# Altium schematic sheet ESP32.SchDoc
size A; SheetNumber: 2; SheetTotal: 6
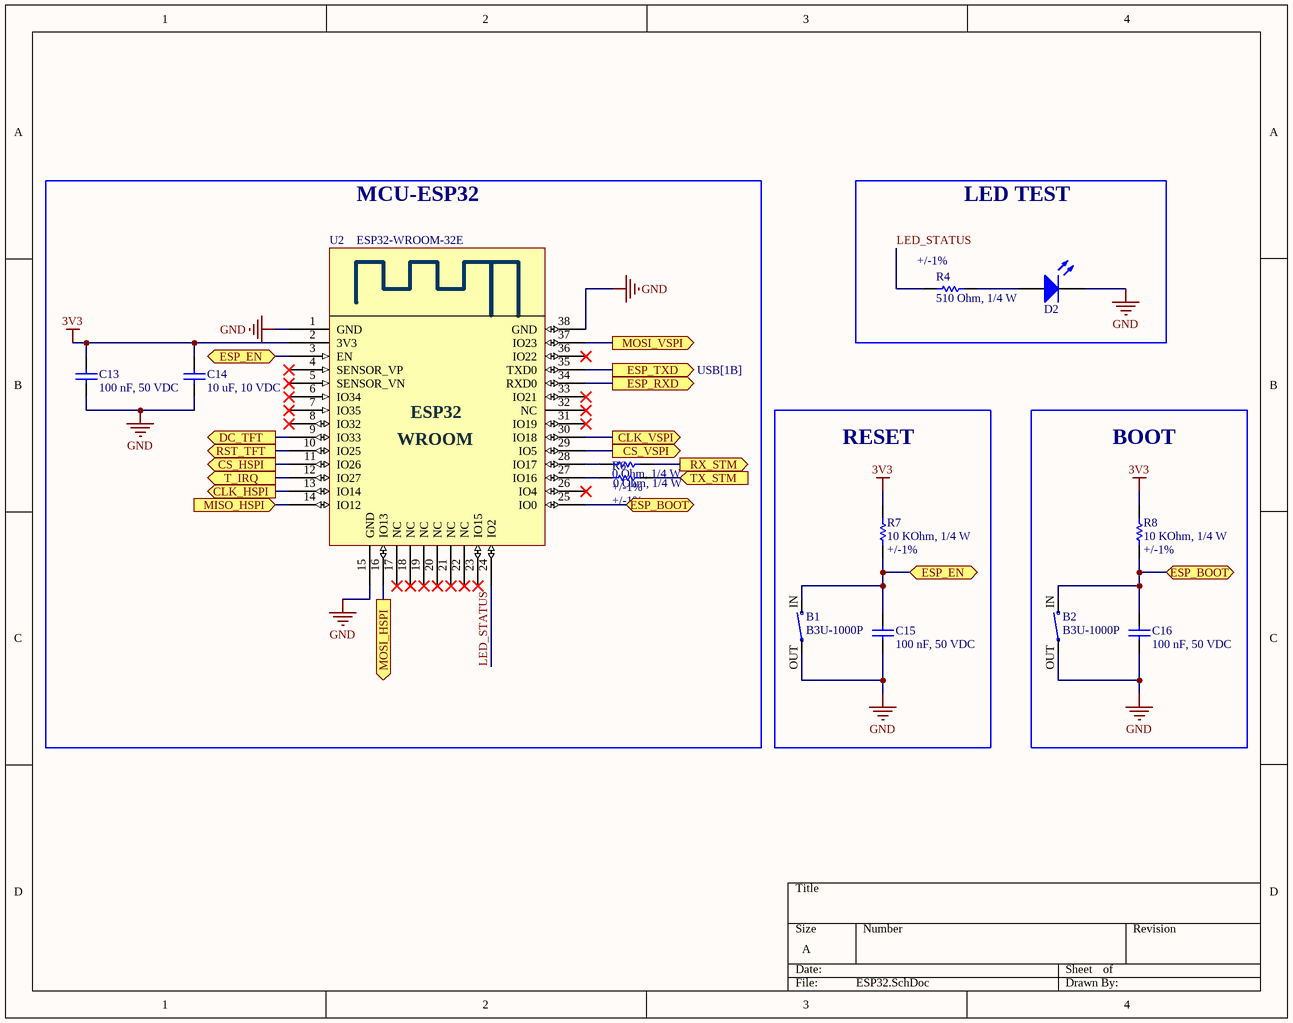
[diagram p0: ESP32.SchDoc]

## Parts
B1  B3U-1000P  [SODFL4025X160N]
B2  B3U-1000P  [SODFL4025X160N]
C13  100 nF, 50 VDC  [CAP_0603]
C14  10 uF, 10 VDC  [CAP_0603]
C15  100 nF, 50 VDC  [CAP_0603]
C16  100 nF, 50 VDC  [CAP_0603]
D2  LED SMD  [LED_0805_Blue]  (value not drawn)
R4  510 Ohm, 1/4 W  Resistance Tolerance: +/-1%  [resistor_0603]
R5  0 Ohm, 1/4 W  Resistance Tolerance: +/-1%  [resistor_0603]
R6  0 Ohm, 1/4 W  Resistance Tolerance: +/-1%  [resistor_0603]
R7  10 KOhm, 1/4 W  Resistance Tolerance: +/-1%  [resistor_0603]
R8  10 KOhm, 1/4 W  Resistance Tolerance: +/-1%  [resistor_0603]
U2  ESP32-WROOM-32E  [ESP32-WROOM]

## Blocks framed on the sheet
MCU-ESP32: C13 C14 R5 R6 U2
LED TEST: D2 R4
RESET: B1 C15 R7
BOOT: B2 C16 R8

## Ports
CLK_HSPI (out, see Input[4B]), CLK_VSPI (out, see Output[4A]), CS_HSPI (out, see Input[4B]), CS_VSPI (out, see Output[4A]), DC_TFT (out, see Output[4A]), ESP_BOOT (bidir, see ESP32[2B], USB[2D]), ESP_BOOT (bidir, see ESP32[4C], USB[2D]), ESP_EN (bidir, see ESP32[1B], USB[2C]), ESP_EN (bidir, see ESP32[3C], USB[2C]), ESP_RXD (out, see USB[1B]), ESP_TXD (out, see USB[1B]), MISO_HSPI (in, see Input[4B]), MOSI_HSPI (out, see Input[4B]), MOSI_VSPI (out, see Output[4A]), RST_TFT (out, see Output[4A]), RX_STM (out, see MCU[1A]), T_IRQ (out, see Input[4B]), TX_STM (in, see MCU[1A])

## Nets
3V3: C13.2 C14.2 R7.2 R8.2 U2.2(3V3)
GND: B1.OUT B2.OUT C13.1 C14.1 C15.1 C16.1 D2.2(K) U2.1(GND) U2.15(GND) U2.38(GND)
CLK_HSPI: U2.13(IO14) ; port CLK_HSPI
CLK_VSPI: U2.30(IO18) ; port CLK_VSPI
CS_HSPI: U2.11(IO26) ; port CS_HSPI
CS_VSPI: U2.29(IO5) ; port CS_VSPI
DC_TFT: U2.9(IO33) ; port DC_TFT
ESP_BOOT: B2.IN C16.2 R8.1 U2.25(IO0) ; port ESP_BOOT
ESP_EN: B1.IN C15.2 R7.1 U2.3(EN) ; port ESP_EN
ESP_RXD: U2.34(RXD0) ; port ESP_RXD
ESP_TXD: U2.35(TXD0) ; port ESP_TXD
LED_STATUS: R4.1 U2.24(IO2)
MISO_HSPI: U2.14(IO12) ; port MISO_HSPI
MOSI_HSPI: U2.16(IO13) ; port MOSI_HSPI
MOSI_VSPI: U2.37(IO23) ; port MOSI_VSPI
RST_TFT: U2.10(IO25) ; port RST_TFT
RX_STM: R5.1 ; port RX_STM
T_IRQ: U2.12(IO27) ; port T_IRQ
TX_STM: R6.1 ; port TX_STM
NetD2_1: D2.1(A) R4.2
NetR5_2: R5.2 U2.28(IO17)
NetR6_2: R6.2 U2.27(IO16)

Not connected (* = marked no-connect by the designer): U2 4(SENSOR_VP)* 5(SENSOR_VN)* 6(IO34)* 7(IO35)* 8(IO32)* 17(NC)* 18(NC)* 19(NC)* 20(NC)* 21(NC)* 22(NC)* 23(IO15)* 26(IO4)* 31(IO19)* 32(NC)* 33(IO21)* 36(IO22)*

## Notes on the sheet
- (in symbol ESP32-WROOM) WROOM

## Library data of the parts
B1 B2 = B3U-1000P: Switch Tactile N.O. SPST Round Button Gull Wing 0.05A 12VDC 1.5N SMD T/R; MF: Omron; MP: B3U1000P; SnapEDA_Link: https://www.snapeda.com/parts/B3U1000P/Omron/view-part/?ref=snap; Package: None; Value: *; Check_prices: https://www.snapeda.com/parts/B3U1000P/Omron/view-part/?ref=eda
C13 C15 C16 = 0106031041050: CAP, size 0603, 100 nF, 50 VDC; Manufacture Name: TDK; Manufacture SN: CGA3E3X8R1H104K080AE; Capacitance: 100 nF; Tolerance: +/-10%; Voltage Rating DC: 50 VDC; ComponentLink2Description: Datasheet; ComponentLink2URL: https://product.tdk.com/system/files/dam/doc/product/capacitor/ceramic/mlcc/catalog/mlcc_automotive_soft_en.pdf?ref_disty=mouser; Operating Temperature: -55 to +125degC; Packaging: Tape and Reel; Mounting Technology: SMT; Size: 0603; Supplier 1 Name: Mouser; Supplier 1 SN: 810-CGA3E3X8R1H104KA; Supplier 1 URL: https://www.mouser.com/ProductDetail/TDK/CGA3E3X8R1H104K080AE?qs=nQSIdc08i%252Bd8g3IRRgU2bw%3D%3D&utm_source=mouser-refine-download&utm_medium=file&utm_campaign=CGA3E3X8R1H104K080AE&utm_content=TDK; Supplier 2 Name: Digi-Key; Supplier 2 SN: 445-173697-2-ND; Supplier 2 URL: https://www.digikey.com/en/products/detail/tdk-corporation/cga3e3x8r1h104k080ae/5809262; Supplier 3 Name: thegioiic; Supplier 3 SN: N/A; Supplier 3 URL: N/A; Value: 100 nF, 50 VDC
C14 = 0106031061010: CAP, size 0603, 10 uF, 10 VDC; Manufacture Name: Samsung Electro-Mechanics; Manufacture SN: CL10A106KP8NNWC; Capacitance: 10 uF; Tolerance: +/-10%; Voltage Rating DC: 10 VDC; ComponentLink2Description: Datasheet; ComponentLink2URL: https://www.mouser.vn/datasheet/2/585/MLCC-1837944.pdf; Operating Temperature: -55 to +125degC; Packaging: Tape and Reel; Mounting Technology: SMT; Size: 0603; Supplier 1 Name: Mouser; Supplier 1 SN: 187-CL10A106KP8NNWC; Supplier 1 URL: https://www.mouser.vn/ProductDetail/Samsung-Electro-Mechanics/CL10A106KP8NNWC?qs=xZ%2FP%252Ba9zWqZx8LSX23YqWA%3D%3D&utm_source=mouser-refine-download&utm_medium=file&utm_campaign=CL10A106KP8NNWC&utm_content=Samsung-Electro-Mechanics; Supplier 2 Name: Digi-Key; Supplier 2 SN: 1276-CL10A106KP8NNWCTR-ND; Supplier 2 URL: https://www.digikey.com/en/products/detail/samsung-electro-mechanics/cl10a106kp8nnwc/16572907; Supplier 3 Name: thegioiic; Supplier 3 SN: N/A; Supplier 3 URL: https://www.thegioiic.com/tu-gom-0603-10uf-25v; Value: 10 uF, 10 VDC
D2 = LED SMD: LED
R4 = 0006035111: RES, size 0603, 510 Ohm, 1/4 W; Manufacture  Name: OEM; Resistance: 510 Ohm; Rated Power: 1/4 W; Size: 0603; Mounting Technology: SMT; Supplier 1 Name: Mouser; Supplier 1 SN: 667-ERJ-UP3F5100V; Supplier 2 Name: Digi-Key; Supplier 2 SN: P17401TR-ND P17401CT-ND P17401DKR-ND; Supplier 1 URL: https://www.mouser.vn/ProductDetail/Panasonic/ERJ-UP3F5100V?qs=sGAEpiMZZMvdGkrng054twq3eZrCFN89dfK8VohwH1n5T5ZGAc92MQ%3D%3D; Supplier 3 Name: thegioiic; Supplier 3 SN: N/A; Supplier 3 URL: N/A; Manufacture  SN: OEM; Value: 510 Ohm, 1/4 W; ComponentLink1Description: Datasheet link; ComponentLink1URL: https://industrial.panasonic.com/cdbs/www-data/pdf/RDN0000/AOA0000C313.pdf; ComponentLink2Description: Supplier 1 URL; ComponentLink2URL: N/A; ComponentLink3Description: Supplier 2 URL; ComponentLink3URL: https://www.digikey.com/en/products/detail/panasonic-electronic-components/ERJ-3BQFR51V/5647434; ComponentLink4Description: Supplier 3 URL; ComponentLink4URL: N/A; Supplier 2 URL: https://www.digikey.com/en/products/detail/panasonic-electronic-components/ERJ-3BQFR51V/5647434
R5 R6 = 0006030001: RES, size 0603, 0 Ohm, 1/4 W; Manufacture  Name: YAGEO; Manufacture  SN: AC0603FR-070RL; Resistance: 0 Ohm; Rated Power: 1/4 W; Size: 0603; Mounting Technology: SMT; Supplier 1 Name: Mouser; Supplier 1 SN: 603-AC0603FR-070RL; Supplier 2 Name: Digi-Key; Supplier 2 SN: 311-0.0LDTR-ND; Supplier 1 URL: https://www.mouser.com/ProductDetail/YAGEO/AC0603FR-070RL?qs=sGAEpiMZZMtlubZbdhIBIOG3KwTtqrl%2FD2D%252BGuMCfoY%3D; Supplier 3 Name: thegioiic; Supplier 3 SN: N/A; Supplier 3 URL: https://www.thegioiic.com/dien-tro-0-ohm-0603-1-; Value: 0 Ohm, 1/4 W; ComponentLink1Description: Datasheet link; ComponentLink1URL: https://www.mouser.com/datasheet/2/447/Yageo_06282023_ACseries-3224032.pdf; ComponentLink2Description: Supplier 1 URL; ComponentLink2URL: N/A; ComponentLink3Description: Supplier 2 URL; ComponentLink3URL: https://www.digikey.com/en/products/detail/yageo/ac0603fr-070rl/2827812; ComponentLink4Description: Supplier 3 URL; ComponentLink4URL: N/A; Supplier 2 URL: https://www.digikey.com/en/products/detail/yageo/ac0603fr-070rl/2827812
R7 R8 = 0006031031: RES, size 0603, 10 KOhm, 1/4 W; Manufacture  Name: OEM; Resistance: 10 KOhm; Rated Power: 1/4 W; Size: 0603; Mounting Technology: SMT; Supplier 1 Name: Mouser; Supplier 1 SN: 755-ESR03EZPF1002; Supplier 2 Name: Digi-Key; Supplier 2 SN: RHM10KADTR-ND RHM10KADCT-ND RHM10KADDKR-ND; Supplier 1 URL: https://www.mouser.vn/ProductDetail/ROHM-Semiconductor/ESR03EZPF1002?qs=sGAEpiMZZMvdGkrng054t67Efho1F8r6CDeAsqwFse8%3D; Supplier 3 Name: thegioiic; Supplier 3 SN: N/A; Supplier 3 URL: N/A; Manufacture  SN: OEM; Value: 10 KOhm, 1/4 W; ComponentLink1Description: Datasheet link; ComponentLink1URL: https://fscdn.rohm.com/en/products/databook/datasheet/passive/resistor/chip_resistor/esr-e.pdf; ComponentLink2Description: Supplier 1 URL; ComponentLink2URL: N/A; ComponentLink3Description: Supplier 2 URL; ComponentLink3URL: https://www.digikey.com/en/products/detail/rohm-semiconductor/ESR03EZPF1002/1983429; ComponentLink4Description: Supplier 3 URL; ComponentLink4URL: N/A; Supplier 2 URL: https://www.digikey.com/en/products/detail/rohm-semiconductor/ESR03EZPF1002/1983429
U2 = ESP32-WROOM: Bluetooth, WiFi 802.11b/g/n, Bluetooth v4.2 +EDR, Class 1, 2 and 3 Transceiver Module 2.4GHz ~ 2.5GHz Integrated, Trace Surface Mount; Mfr: Espressif Systems; Utilized IC / Part: ESP32-D0WD-V3; Modulation: CCK, DSSS, OFDM; Data Rate: 150Mbps; Power - Output: 20dBm; Sensitivity: -98dBm; Serial Interfaces: ADC, GPIO, I²C, I²S, PWM, SDIO, SPI, UART; Memory Size: 4MB Flash, 448kB ROM, 536kB SRAM; Voltage - Supply: 3V ~ 3.6V; Category: RF and Wireless; Series: ESP32; RF Family/Standard: Bluetooth, WiFi; Protocol: 802.11b/g/n, Bluetooth v4.2 +EDR, Class 1, 2 and 3; Frequency: 2.4GHz ~ 2.5GHz; Antenna Type: Integrated, Trace; Mounting Type: Surface Mount; ComponentLink1Description: Hshop; ComponentLink1URL: https://hshop.vn/products/mach-thu-phat-wifi-ble-soc-esp32-v1; Operating Temperature: -40°C ~ 85°C; ComponentLink2Description: Datasheet; ComponentLink2URL: https://www.espressif.com/sites/default/files/russianDocumentation/esp32-wroom-32e_esp32-wroom-32ue_datasheet_en.pdf